# EAGLE design chareger (EAGLE 7.6.0)
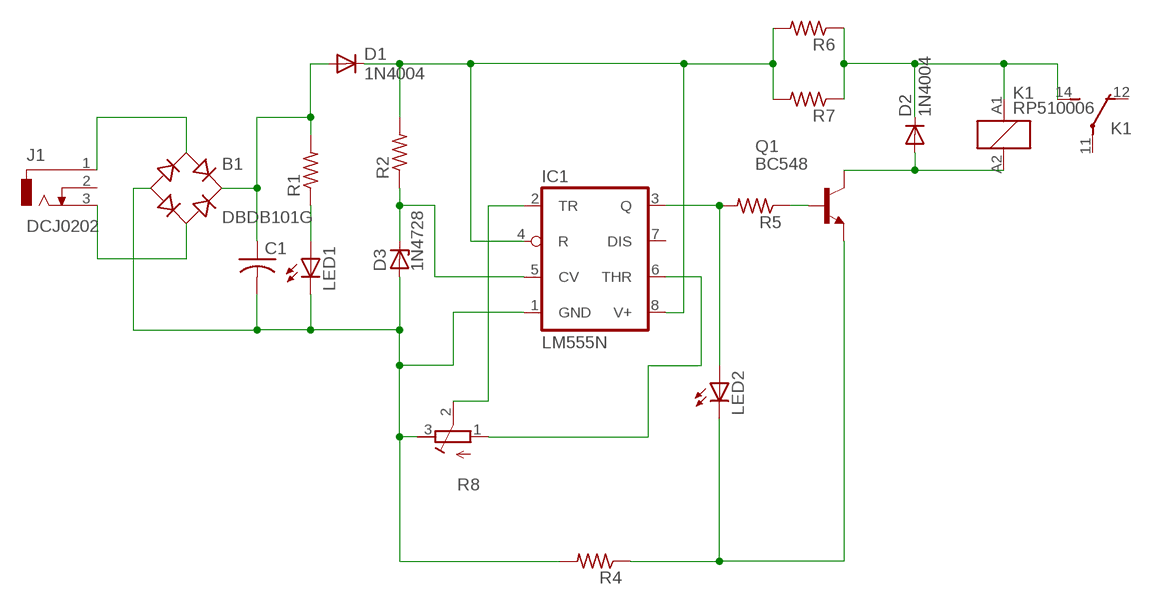
[diagram p0: schematic, sheet 1]

## Parts
B1  DBDB101G  [DB]
C1  C-US025-050X050  [C025-050X050]
D1  1N4004  [DO41-10]
D2  1N4004  [DO41-10]
D3  1N4728  [DO41Z10]
IC1  LM555N  [DIL08-ROUND]
J1  DCJ0202  [DCJ0202]
K1  RP510006  [RP51]
LED1  LEDB152  [Q62902-B152]
LED2  LEDB152  [Q62902-B152]
Q1  BC548  [TO92-EBC]
R1  R-US_0204/5  [0204/5]
R2  R-US_0204/5  [0204/5]
R4  R-US_0204/5  [0204/5]
R5  R-US_0204/5  [0204/5]
R6  R-US_0204/5  [0204/5]
R7  R-US_0204/5  [0204/5]
R8  R-TRIMM74X  [RTRIM74X]

## Nets
GND: B1.- C1.2 D3.A IC1.1(GND) LED1.K(C) R4.2 R8.3(E)
N$1: B1.AC1 J1.1
N$2: B1.AC2 J1.3
N$4: B1.+ C1.1 D1.A R1.2
N$5: D1.C IC1.4(R) IC1.8(V+) R2.2 R6.2 R7.2
N$6: D3.C IC1.5(CV) R2.1
N$7: IC1.2(TR) R8.2(S)
N$8: IC1.6(THR) R8.1(A)
N$9: Q1.B R5.1
N$10: IC1.3(Q) LED2.A R5.2
N$11: LED2.K(C) Q1.E R4.1
N$12: D2.A K1.A2 Q1.C
N$13: LED1.A R1.1
N$14: D2.C K1.14(2:S) K1.A1 R6.1 R7.1
Unconnected: IC1.7(DIS) J1.2 K1.11(2:P) K1.12(2:O)

## Library data of the parts
B1 = rectifier:DB?*G: Single Phase 1.0 AMP Glass Passivated Bridge Rectifier Taiwan Semiconductor Co.,Ltd. - TSC Source: http://www.taiwansemi.com/TSCbig5/ezcatfiles/cust/img/img/db101g.pdf http://www.ts.com.tw/db/pictures/modules/PDT/PDT060207001/DBLS201G.pdf
C1 = adafruit:C-US: CAPACITOR, American symbol
D1 D2 = adafruit:1N4004: DIODE General purpose 1N400x type rectifier (With bigger pads) http://www.ladyada.net/library/pcb/eaglelibrary.html
D3 = diode:1N4728: Z DIODE 3.3 V, 1W, 5 percent
IC1 = adafruit:*555: TIMER Changed DIP package to have round (not oval) pin pads http://www.ladyada.net/library/pcb/eaglelibrary.html
J1 = con-jack:DCJ0202: DC POWER JACK Source: DCJ0202.pdf; OC_FARNELL: unknown; OC_NEWARK: unknown
K1 = relay:RP51*: Power PCB Relay RP I SCHRACK 1 pole 8 A Vertical version Source: http://www.schrack.com/.. 5845.pdf; OC_FARNELL: unknown; OC_NEWARK: unknown
LED1 LED2 = adafruit:LED: LED OSRAM: - CHIPLED LG R971, LG N971, LY N971, LG Q971, LY Q971, LO R971, LY R971 LH N974, LH R974 LS Q976, LO Q976, LY Q976 LO Q996 - Hyper CHIPLED LW Q18S LB Q993, LB Q99A, LB R99A - SideLED LS A670, LO A670, LY A670, LG A670, LP A670 LB A673, LV A673, LT A673, LW A673 LH A674 LY A675 LS A676, LA A676, LO A676, LY A676, LW A676 LS A679, LY A679, LG A679 - Hyper Micro SIDELED® LS Y876, LA Y876, LO Y876, LY Y876 LT Y87S - SmartLED LW L88C, LW L88S LB L89C, LB L89S, LG L890 LS L89K, LO L89K, LY L89K LS L896, LA L896, LO L896, LY L896 - TOPLED LS T670, LO T670, LY T670, LG T670, LP T670 LSG T670, LSP T670, LSY T670, LOP T670, LYG T670 LG T671, LOG T671, LSG T671 LB T673, LV T673, LT T673, LW T673 LH T674 LS T676, LA T676, LO T676, LY T676, LB T676, LH T676, LSB T676, LW T676 LB T67C, LV T67C, LT T67C, LS T67K, LO T67K, LY T67K, LW E67C LS E67B, LA E67B, LO E67B, LY E67B, LB E67C, LV E67C, LT E67C LW T67C LS T679, LY T679, LG T679 LS T770, LO T770, LY T770, LG T770, LP T770 LB T773, LV T773, LT T773, LW T773 LH T774 LS E675, LA E675, LY E675, LS T675 LS T776, LA T776, LO T776, LY T776, LB T776 LHGB T686 LT T68C, LB T68C - Hyper Mini TOPLED® LB M676 - Mini TOPLED Santana® LG M470 LS M47K, LO M47K, LY M47K Source: http://www.osram.convergy.de/
Q1 = transistor-npn:BC548*: NPN Transistor
R1 R2 R4-R7 = adafruit:R-US_: RESISTOR, American symbol
R8 = rcl:R-TRIMM: Trimm resistor

## Board
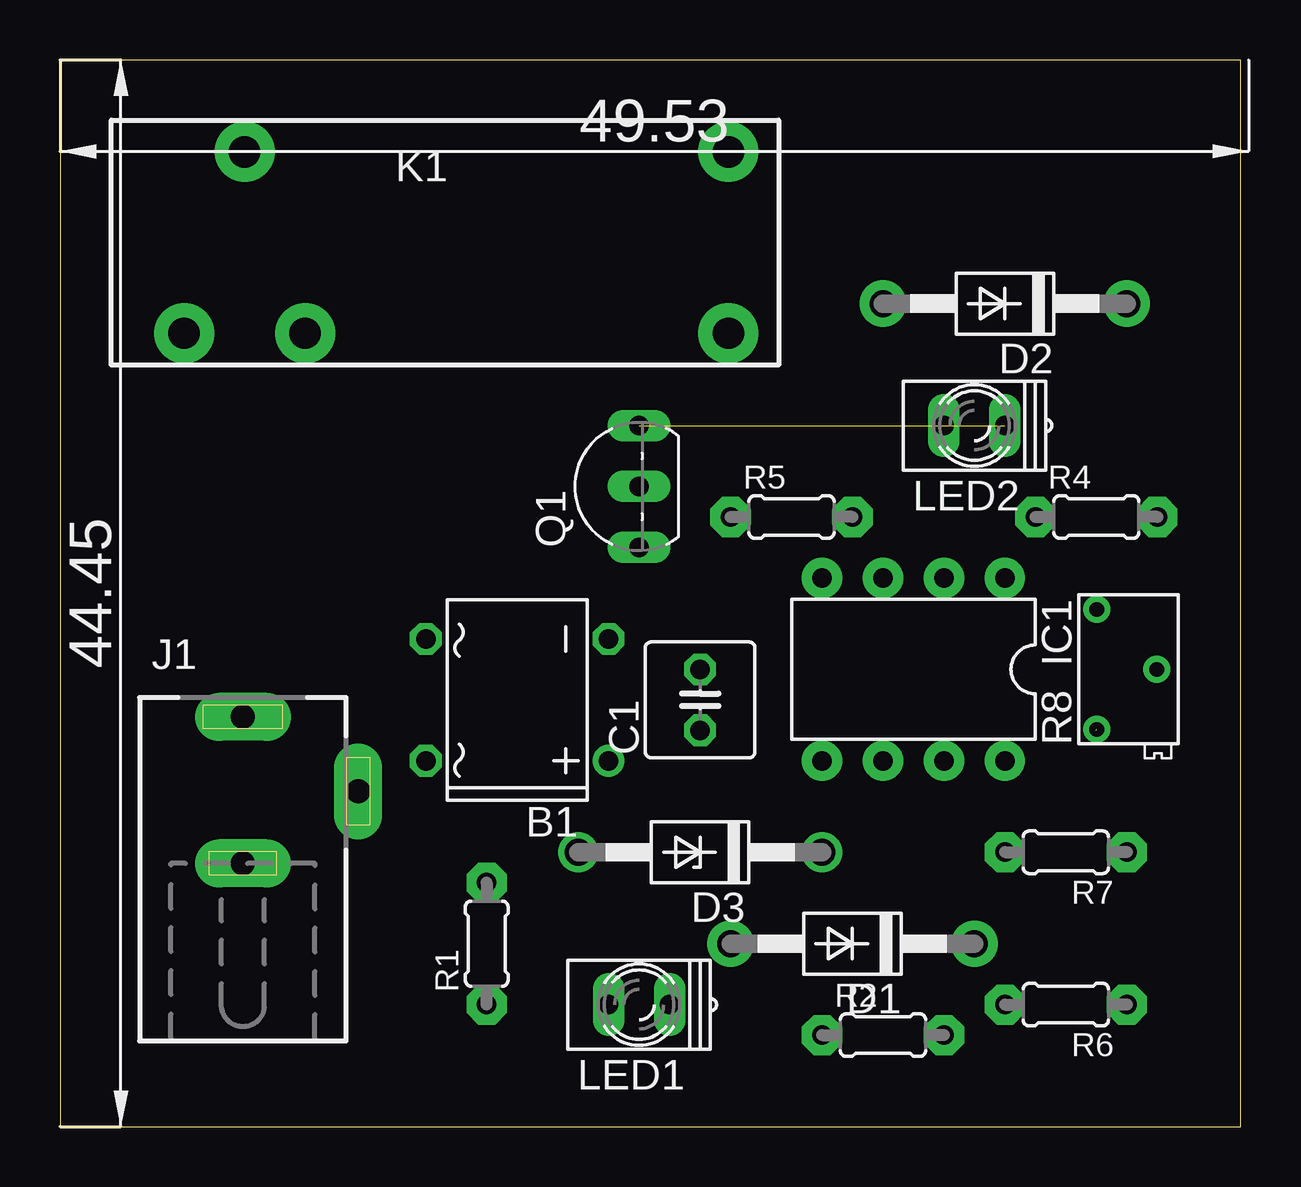
[diagram p1: board, top side]
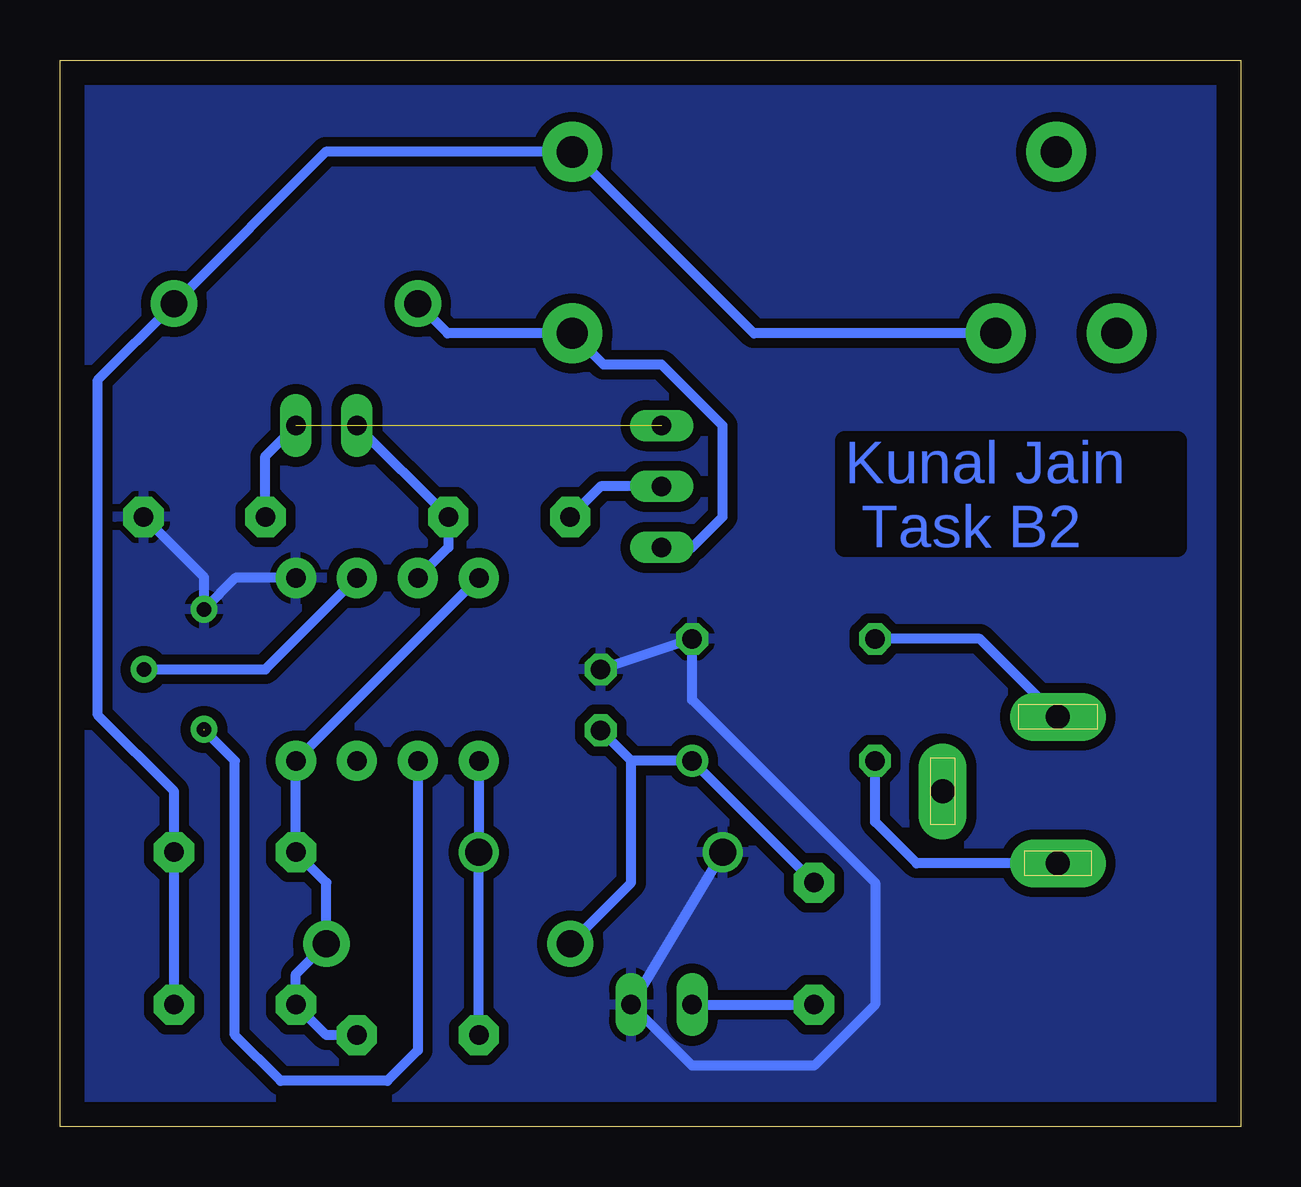
[diagram p2: board, bottom side, seen from below]

Size 49.2 x 44.44 mm. Coordinates in mm from the lower left corner, seen from the top.
Outline: 0,0 49.2,0 49.2,44.44 0,44.44 0,0
Copper layers (1*16): Top 0.035mm / dielectric 1.5mm / Bottom 0.035mm
Design rules "default *": minimum track width 10mil, minimum drill 24mil, track to track 16mil, track to pad 16mil, pad to pad 8mil, via to via 8mil, smd to smd 8mil, copper to edge 40mil, drill to drill 8mil, minimum pad ring 10mil, minimum via ring 8mil, stop-mask expansion 4mil, vias tented up to drill 0mil, thermal gap 10mil

### Footprints (pad centres in the part's own frame; a part is rotated, then mirrored left to right if it is on the bottom)
DB = drill 0.813: + -2.54,-3.81 | drill 0.813 octagon: - 2.54,-3.81; AC1 2.54,3.81; AC2 -2.54,3.81
C025-050X050 = drill 0.813 octagon: 1 -1.27,0; 2 1.27,0
DO41-10 = drill 1.118 pad 1.93: A 5.08,0; C -5.08,0
DO41Z10 = drill 1.118: A 5.08,0; C -5.08,0
DIL08-ROUND = drill 0.813 pad 1.676: 1 -3.81,-3.81; 2 -1.27,-3.81; 3 1.27,-3.81; 4 3.81,-3.81; 5 3.81,3.81; 6 1.27,3.81; 7 -1.27,3.81; 8 -3.81,3.81
DCJ0202 = drill 1 pad 2 long: 1 0,3.1; 2 4.8,0; 3 0,-3
RP51 = drill 1.3 pad 2.5: 11 -8.82,3.78; 12 -11.34,-3.78; 14 -6.3,-3.78; A1 11.34,3.78; A2 11.34,-3.78
Q62902-B152 = drill 0.813 long: A 1.27,0; K -1.27,0
TO92-EBC = drill 0.813 long: B 0,-1.27; C -2.54,-1.27; E 2.54,-1.27
0204/5 = drill 0.813 pad 1.676 octagon: 1 -2.54,0; 2 2.54,0
RTRIM74X = drill 0.61: 1 -1.25,-2.5; 2 1.25,0; 3 -1.25,2.5

### Placement (x,y rotation side)
B1  19.05,17.78 90 top
C1  26.67,17.78 90 top
D1  33.02,7.62 180 top
D2  39.37,34.29 180 top
D3  26.67,11.43 180 top
IC1  35.56,19.05 180 top
J1  7.62,13.97 0 top
K1  16.51,36.83 0 top
LED1  24.13,5.08 180 top
LED2  38.1,29.21 180 top
Q1  22.86,26.67 90 top
R1  17.78,7.62 90 top
R2  34.29,3.81 0 top
R4  43.18,25.4 0 top
R5  30.48,25.4 0 top
R6  41.91,5.08 180 top
R7  41.91,11.43 180 top
R8  44.45,19.05 0 top

### Tracks (layer width: path | path; a pad name or v marks a point on that pad's centre or on a via)
GND
  Bottom 0.406: C1.2 B1.- 22.86,17.78 15.24,10.16 15.24,5.08 17.78,2.54 22.86,2.54 LED1.K D3.A | IC1.1 41.89,22.86 R8.3 43.2,22.88 R4.2
  pour Bottom: 0,44.45 49.53,44.45 49.53,0 0,0
N$1
  Bottom 0.406: J1.1 10.87,20.32 B1.AC1
N$2
  Bottom 0.406: J1.3 13.51,10.97 15.24,12.7 B1.AC2
N$4
  Bottom 0.406: 25.4,15.24 B1.+ R1.2 | 25.4,15.24 C1.1 | D1.A 25.4,10.16 25.4,15.24
N$5
  Bottom 0.406: R2.2 38.1,3.81 R6.2 39.37,6.35 D1.C 38.1,10.16 R7.2 IC1.8 IC1.4
N$6
  Bottom 0.406: R2.1 D3.C IC1.5
N$7
  Bottom 0.406: R8.2 40.64,19.05 IC1.2
N$8  (1 unrouted)
  Bottom 0.406: IC1.6 34.29,3.17 35.56,1.91 40.01,1.91 41.91,3.81 41.91,15.24 43.18,16.51
N$9
  Bottom 0.406: Q1.B 26.67,26.67 R5.1
N$10
  Bottom 0.406: IC1.3 33.02,24.13 R5.2 LED2.A
N$11  (1 unrouted)
  Bottom 0.406: R4.1 40.64,27.94 LED2.K
N$12
  Bottom 0.406: Q1.C 22.86,24.13 21.59,25.4 21.59,29.21 24.13,31.75 26.55,31.75 K1.A2 33.05,33.05 D2.A
N$13
  Bottom 0.406: LED1.A R1.1
N$14
  Bottom 0.406: R6.1 R7.1 44.45,13.97 47.62,17.14 47.62,31.11 D2.C 38.13,40.61 K1.A1 20.29,33.05 K1.14

### Text on the board
Bottom: Kunal Jain / Task B2